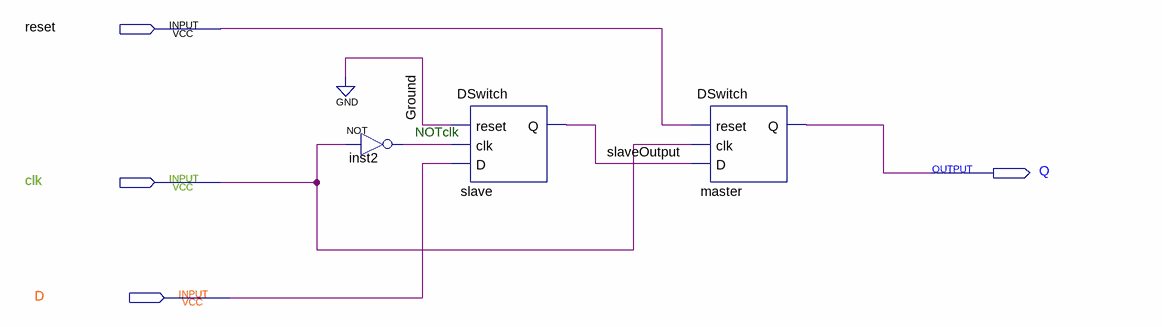
[diagram p0: schematic sheet]
// Quartus schematic Flopr.bdf as structural Verilog: 3 symbols, 4 pins
module Flopr (
  input  reset,
  input  clk,
  input  D,
  output Q
);

  wire NOTclk, slaveOutput;

  not inst2 (NOTclk, clk);
  DSwitch slave (.reset(1'b0), .clk(NOTclk), .D(D), .Q(slaveOutput));
  DSwitch master (.reset(reset), .clk(clk), .D(slaveOutput), .Q(Q));
endmodule
